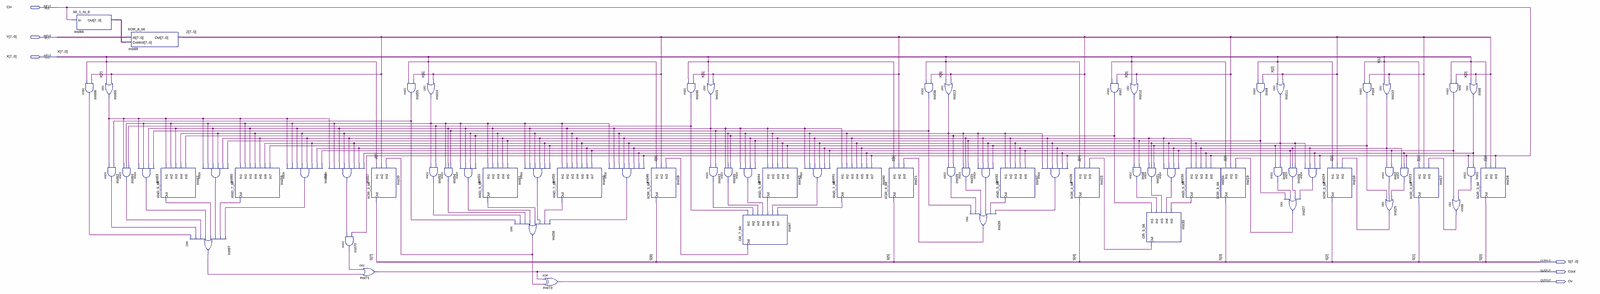
[diagram p0: schematic sheet, whole]
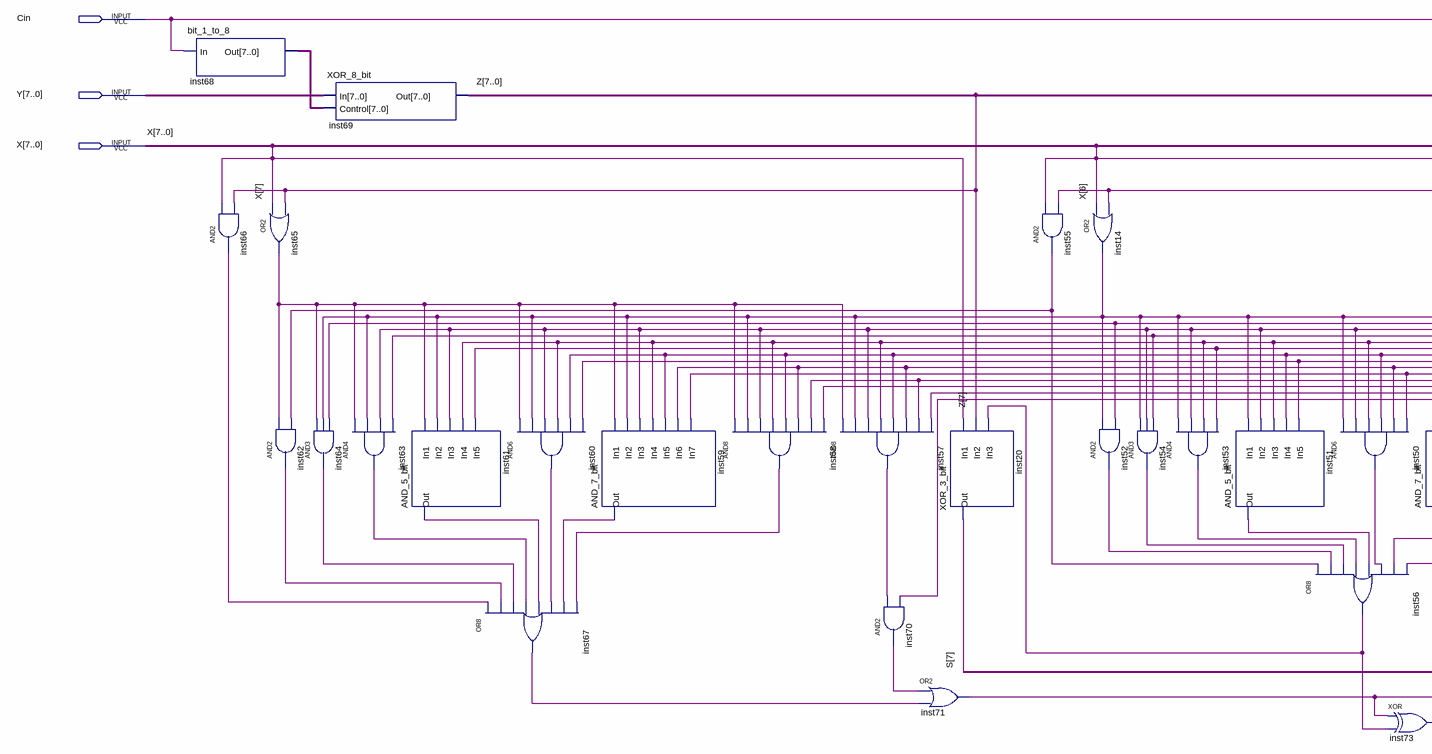
[diagram p1: schematic sheet, left part]
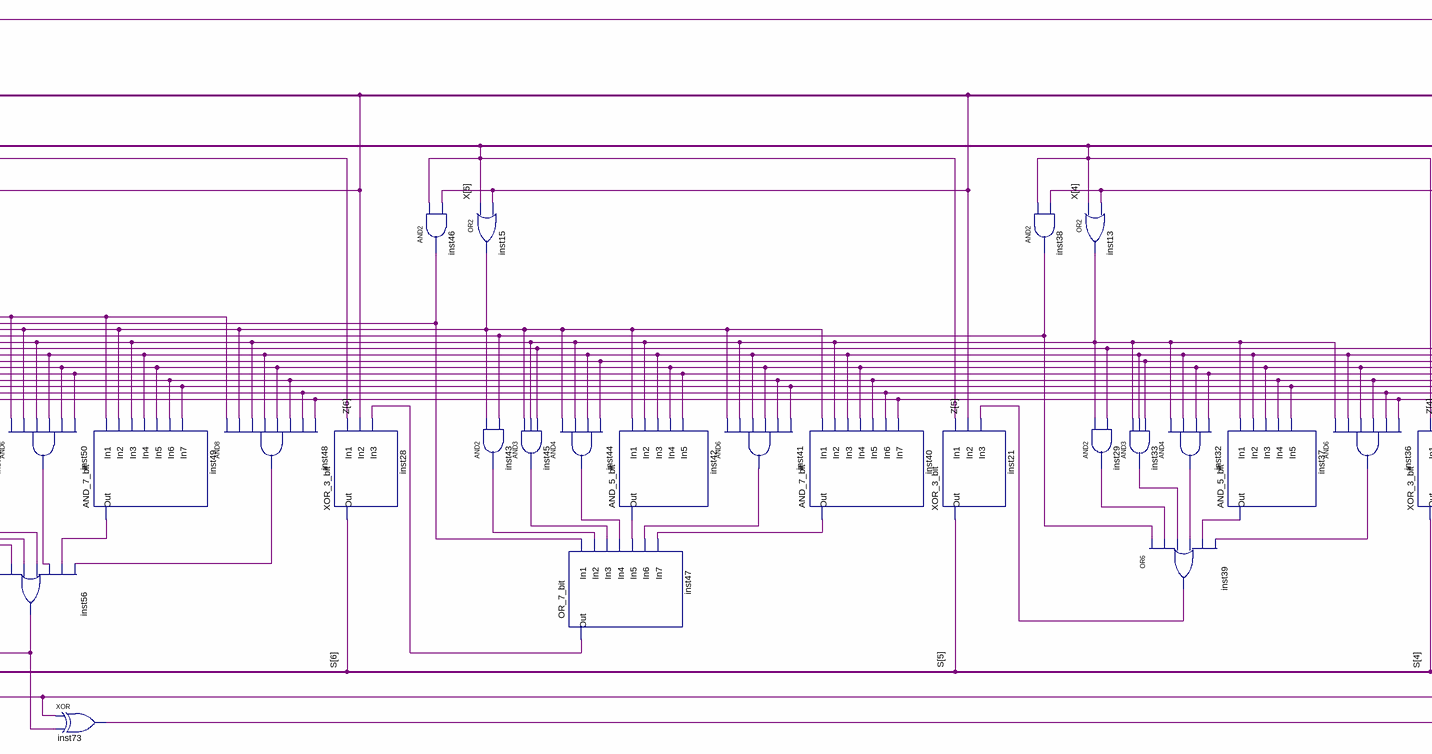
[diagram p2: schematic sheet, centre part]
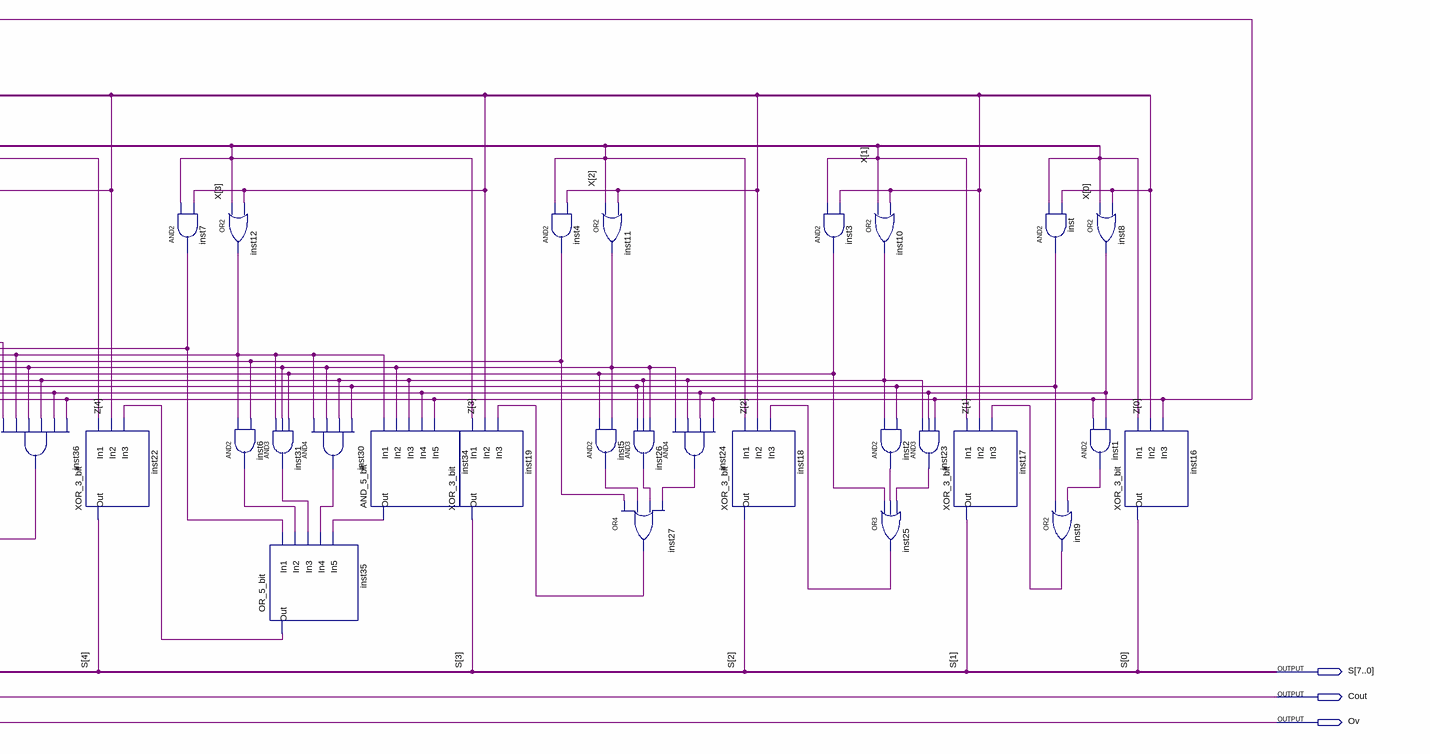
[diagram p3: schematic sheet, right part]
// Quartus schematic CLA_8_bit.bdf as structural Verilog: 73 symbols, 6 pins
module CLA_8_bit (
  input  Cin,
  input  [7:0] Y,
  input  [7:0] X,
  output [7:0] S,
  output Cout,
  output Ov
);

  wire inst1_out, inst2_out, inst3_out, inst4_out, inst5_out, inst6_out, inst7_out, inst8_out, inst9_out,
       inst10_out, inst11_out, inst12_out, inst13_out, inst14_out, inst15_out, inst23_out, inst24_out,
       inst25_out, inst26_out, inst27_out, inst29_out, inst30_out, inst31_out, inst32_out, inst33_out,
       inst34_out, inst35_out, inst36_out, inst37_out, inst38_out, inst39_out, inst40_out, inst41_out,
       inst42_out, inst43_out, inst44_out, inst45_out, inst46_out, inst47_out, inst48_out, inst49_out,
       inst50_out, inst51_out, inst52_out, inst53_out, inst54_out, inst55_out, inst56_out, inst57_out,
       inst58_out, inst59_out, inst60_out, inst61_out, inst62_out, inst63_out, inst64_out, inst65_out,
       inst66_out, inst67_out, inst70_out, inst_out;
  wire [7:0] inst68_out, Z;

  bit_1_to_8 inst68 (.In(Cin), .Out(inst68_out));
  and inst66 (inst66_out, X[7], Z[7]);
  or inst65 (inst65_out, X[7], Z[7]);
  and inst62 (inst62_out, inst65_out, inst55_out);
  and inst64 (inst64_out, inst65_out, inst14_out, inst46_out);
  XOR_8_bit inst69 (.In(Y), .Control(inst68_out), .Out(Z));
  and inst63 (inst63_out, inst65_out, inst14_out, inst15_out, inst38_out);
  AND_5_bit inst61 (
    .In1(inst65_out), .In2(inst14_out), .In3(inst15_out), .In4(inst13_out), .In5(inst7_out), .Out(inst61_out));
  and inst60 (inst60_out, inst65_out, inst14_out, inst15_out, inst13_out, inst12_out, inst4_out);
  or inst67 (inst67_out, inst66_out, inst62_out, inst64_out, inst63_out, inst61_out, inst60_out, inst59_out, inst58_out);
  AND_7_bit inst59 (
    .In1(inst65_out), .In2(inst14_out), .In3(inst15_out), .In4(inst13_out), .In5(inst12_out),
    .In6(inst11_out), .In7(inst3_out), .Out(inst59_out));
  and inst58 (inst58_out, inst65_out, inst14_out, inst15_out, inst13_out, inst12_out, inst11_out, inst10_out, inst_out);
  and inst57 (inst57_out, inst65_out, inst14_out, inst15_out, inst13_out, inst12_out, inst11_out, inst10_out, inst8_out);
  and inst70 (inst70_out, inst57_out, Cin);
  or inst71 (Cout, inst70_out, inst67_out);
  XOR_3_bit inst20 (.In1(X[7]), .In2(Z[7]), .In3(inst56_out), .Out(S[7]));
  and inst55 (inst55_out, X[6], Z[6]);
  or inst14 (inst14_out, X[6], Z[6]);
  and inst52 (inst52_out, inst14_out, inst46_out);
  and inst53 (inst53_out, inst14_out, inst15_out, inst13_out, inst7_out);
  and inst54 (inst54_out, inst14_out, inst15_out, inst38_out);
  AND_5_bit inst51 (
    .In1(inst14_out), .In2(inst15_out), .In3(inst13_out), .In4(inst12_out), .In5(inst4_out), .Out(inst51_out));
  or inst56 (inst56_out, inst55_out, inst52_out, inst54_out, inst53_out, inst51_out, inst50_out, inst49_out, inst48_out);
  and inst50 (inst50_out, inst14_out, inst15_out, inst13_out, inst12_out, inst11_out, inst3_out);
  AND_7_bit inst49 (
    .In1(inst14_out), .In2(inst15_out), .In3(inst13_out), .In4(inst12_out), .In5(inst11_out),
    .In6(inst10_out), .In7(inst_out), .Out(inst49_out));
  xor inst73 (Ov, Cout, inst56_out);
  and inst48 (inst48_out, inst14_out, inst15_out, inst13_out, inst12_out, inst11_out, inst10_out, inst8_out, Cin);
  XOR_3_bit inst28 (.In1(X[6]), .In2(Z[6]), .In3(inst47_out), .Out(S[6]));
  and inst46 (inst46_out, X[5], Z[5]);
  or inst15 (inst15_out, X[5], Z[5]);
  and inst43 (inst43_out, inst15_out, inst38_out);
  and inst44 (inst44_out, inst15_out, inst13_out, inst12_out, inst4_out);
  and inst45 (inst45_out, inst15_out, inst13_out, inst7_out);
  OR_7_bit inst47 (
    .In1(inst46_out), .In2(inst43_out), .In3(inst45_out), .In4(inst44_out), .In5(inst42_out),
    .In6(inst41_out), .In7(inst40_out), .Out(inst47_out));
  AND_5_bit inst42 (
    .In1(inst15_out), .In2(inst13_out), .In3(inst12_out), .In4(inst11_out), .In5(inst3_out), .Out(inst42_out));
  and inst41 (inst41_out, inst15_out, inst13_out, inst12_out, inst11_out, inst10_out, inst_out);
  AND_7_bit inst40 (
    .In1(inst15_out), .In2(inst13_out), .In3(inst12_out), .In4(inst11_out), .In5(inst10_out),
    .In6(inst8_out), .In7(Cin), .Out(inst40_out));
  XOR_3_bit inst21 (.In1(X[5]), .In2(Z[5]), .In3(inst39_out), .Out(S[5]));
  and inst38 (inst38_out, X[4], Z[4]);
  or inst13 (inst13_out, X[4], Z[4]);
  and inst29 (inst29_out, inst13_out, inst7_out);
  and inst32 (inst32_out, inst13_out, inst12_out, inst11_out, inst3_out);
  and inst33 (inst33_out, inst13_out, inst12_out, inst4_out);
  or inst39 (inst39_out, inst38_out, inst29_out, inst33_out, inst32_out, inst37_out, inst36_out);
  AND_5_bit inst37 (
    .In1(inst13_out), .In2(inst12_out), .In3(inst11_out), .In4(inst10_out), .In5(inst_out), .Out(inst37_out));
  and inst36 (inst36_out, inst13_out, inst12_out, inst11_out, inst10_out, inst8_out, Cin);
  XOR_3_bit inst22 (.In1(X[4]), .In2(Z[4]), .In3(inst35_out), .Out(S[4]));
  and inst7 (inst7_out, X[3], Z[3]);
  or inst12 (inst12_out, X[3], Z[3]);
  and inst6 (inst6_out, inst12_out, inst4_out);
  and inst31 (inst31_out, inst12_out, inst11_out, inst3_out);
  OR_5_bit inst35 (
    .In1(inst7_out), .In2(inst6_out), .In3(inst31_out), .In4(inst30_out), .In5(inst34_out), .Out(inst35_out));
  and inst30 (inst30_out, inst12_out, inst11_out, inst10_out, inst_out);
  AND_5_bit inst34 (.In1(inst12_out), .In2(inst11_out), .In3(inst10_out), .In4(inst8_out), .In5(Cin), .Out(inst34_out));
  XOR_3_bit inst19 (.In1(X[3]), .In2(Z[3]), .In3(inst27_out), .Out(S[3]));
  and inst4 (inst4_out, X[2], Z[2]);
  and inst5 (inst5_out, inst3_out, inst11_out);
  or inst11 (inst11_out, X[2], Z[2]);
  and inst26 (inst26_out, inst_out, inst10_out, inst11_out);
  or inst27 (inst27_out, inst4_out, inst5_out, inst26_out, inst24_out);
  and inst24 (inst24_out, inst11_out, inst10_out, inst8_out, Cin);
  XOR_3_bit inst18 (.In1(X[2]), .In2(Z[2]), .In3(inst25_out), .Out(S[2]));
  and inst3 (inst3_out, X[1], Z[1]);
  or inst10 (inst10_out, X[1], Z[1]);
  and inst2 (inst2_out, inst10_out, inst_out);
  or inst25 (inst25_out, inst3_out, inst2_out, inst23_out);
  and inst23 (inst23_out, inst10_out, inst8_out, Cin);
  XOR_3_bit inst17 (.In1(X[1]), .In2(Z[1]), .In3(inst9_out), .Out(S[1]));
  and inst (inst_out, X[0], Z[0]);
  or inst9 (inst9_out, inst_out, inst1_out);
  or inst8 (inst8_out, X[0], Z[0]);
  and inst1 (inst1_out, Cin, inst8_out);
  XOR_3_bit inst16 (.In1(X[0]), .In2(Z[0]), .In3(Cin), .Out(S[0]));
endmodule
